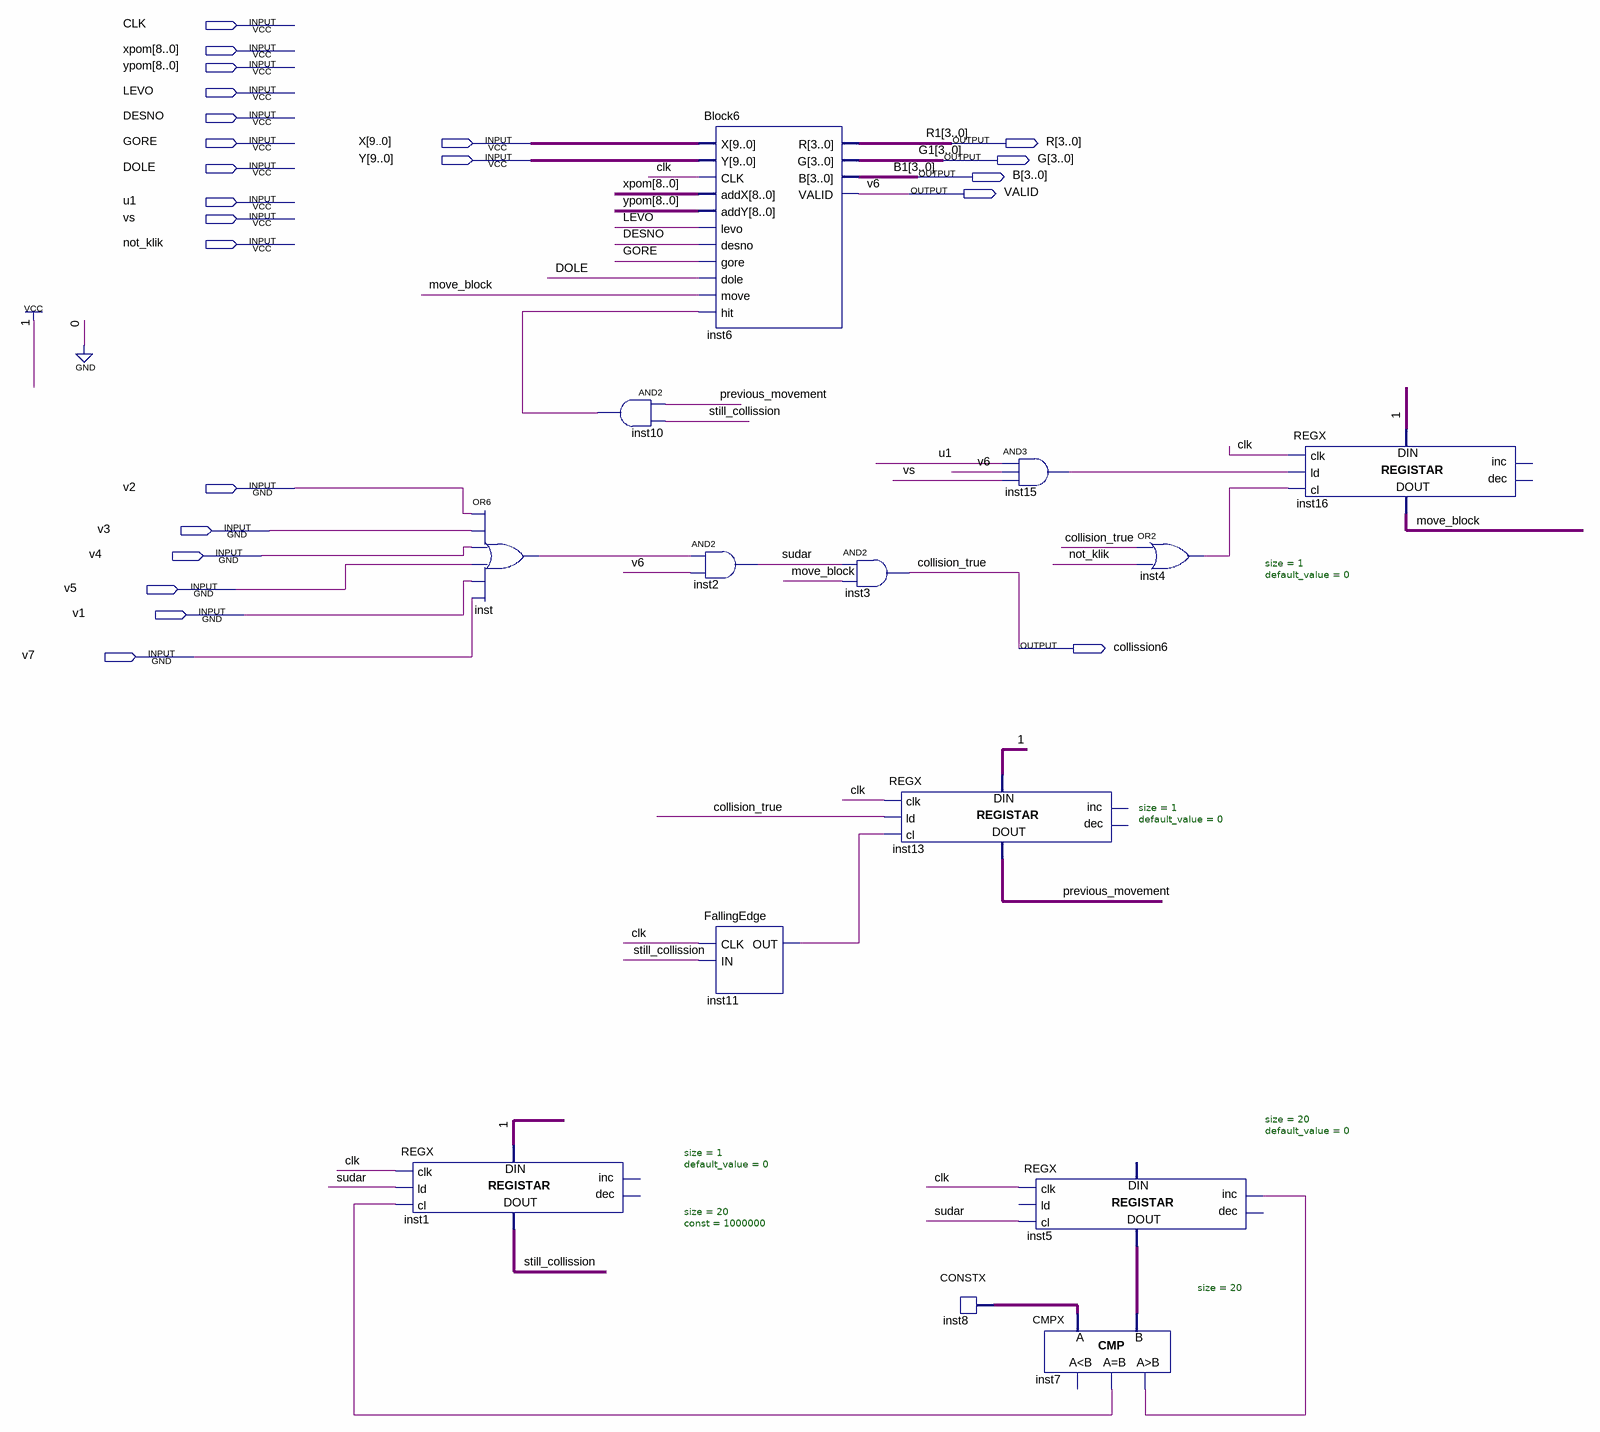
[diagram p0: schematic sheet]
// Quartus schematic blok6sema.bdf as structural Verilog: 14 symbols, 23 pins
module blok6sema (
  input  CLK,
  input  [8:0] xpom,
  input  [8:0] ypom,
  input  LEVO,
  input  DESNO,
  input  GORE,
  input  [9:0] X,
  input  [9:0] Y,
  input  DOLE,
  input  u1,
  input  vs,
  input  not_klik,
  input  v2,
  input  v3,
  input  v4,
  input  v5,
  input  v1,
  input  v7,
  output [3:0] R,
  output [3:0] G,
  output [3:0] B,
  output VALID,
  output collission6
);

  wire inst4_out, inst7_eq, inst7_gr, inst10_out, inst11_out, inst15_out, inst_out, move_block,
       previous_movement, still_collission, sudar;
  wire [19:0] inst5_data_out, inst8_data;

  REGX #(.size(1), .default_value(0)) inst1 (
    .clk(CLK), .ld(sudar), .cl(inst7_eq), .data_in(1'b1), .data_out(still_collission));  // open: inc, dec
  or inst (inst_out, v2, v3, v4, v5, v1, v7);
  and inst10 (inst10_out, previous_movement, still_collission);
  Block6 inst6 (
    .X(X), .Y(Y), .CLK(CLK), .addX(xpom), .addY(ypom), .levo(LEVO), .desno(DESNO), .gore(GORE), .dole(DOLE),
    .move(move_block), .hit(inst10_out), .R(R), .G(G), .B(B), .VALID(VALID));
  and inst2 (sudar, inst_out, VALID);
  FallingEdge inst11 (.CLK(CLK), .IN(still_collission), .OUT(inst11_out));
  and inst3 (collission6, sudar, move_block);
  REGX #(.size(1), .default_value(0)) inst13 (
    .clk(CLK), .ld(collission6), .cl(inst11_out), .data_in(1'b1), .data_out(previous_movement));  // open: inc, dec
  CONSTX #(.size(20), .\const (1000000)) inst8 (.data(inst8_data));
  and inst15 (inst15_out, u1, VALID, vs);
  REGX #(.size(20), .default_value(0)) inst5 (
    .clk(CLK), .cl(sudar), .inc(inst7_gr), .data_out(inst5_data_out));  // open: ld, dec, data_in
  CMPX #(.size(20)) inst7 (.A(inst8_data), .B(inst5_data_out), .eq(inst7_eq), .gr(inst7_gr));  // open: ls
  or inst4 (inst4_out, collission6, not_klik);
  REGX #(.size(1), .default_value(0)) inst16 (
    .clk(CLK), .ld(inst15_out), .cl(inst4_out), .data_in(1'b1), .data_out(move_block));  // open: inc, dec

  // Other names for the same wires on the sheet: B1[3:0] = B; collision_true = collission6; G1[3:0] = G; R1[3:0] = R;
  //   v6 = VALID
endmodule
